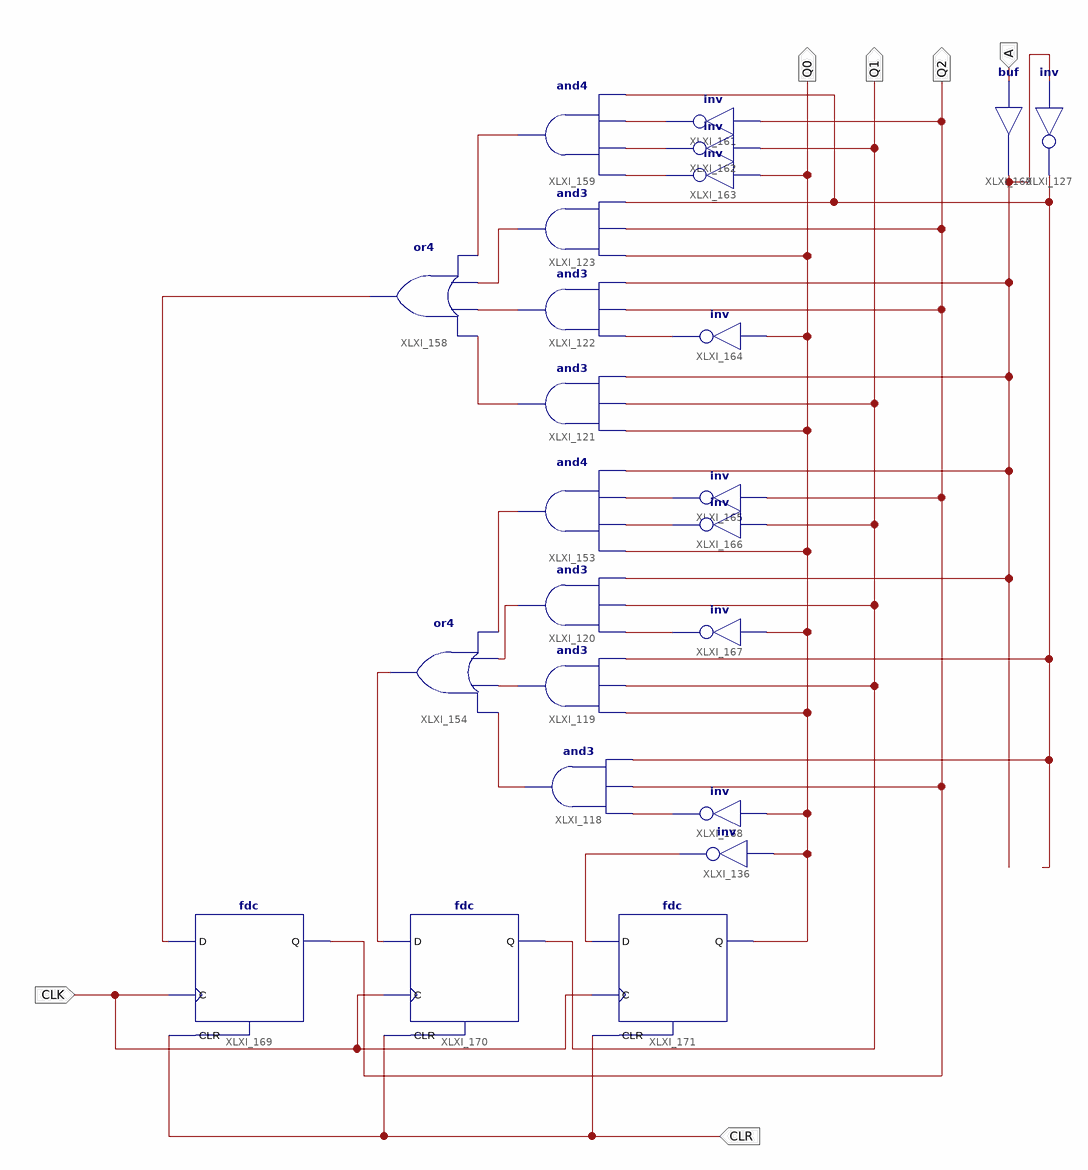
[diagram p0: schematic sheet 1]
// Xilinx ISE schematic Module_Six_Up_Down_Counter.sch (spartan3e) as structural Verilog: 24 symbols, 6 ports
module Module_Six_Up_Down_Counter (
  input  CLK,
  input  A,
  input  CLR,
  output Q0,
  output Q1,
  output Q2
);

  wire XLXN_157, XLXN_158, XLXN_159, XLXN_161, XLXN_162, XLXN_163, XLXN_166, XLXN_189, XLXN_211, XLXN_222,
       XLXN_223, XLXN_227, XLXN_237, XLXN_238, XLXN_239, XLXN_240, XLXN_241, XLXN_242, XLXN_243, XLXN_244,
       XLXN_245;

  not XLXI_127 (XLXN_237, XLXN_227);
  and XLXI_120 (XLXN_157, XLXN_227, Q1, XLXN_244);
  and XLXI_118 (XLXN_159, XLXN_237, Q2, XLXN_245);
  not XLXI_136 (XLXN_189, Q0);
  and XLXI_123 (XLXN_222, XLXN_237, Q2, Q0);
  and XLXI_121 (XLXN_162, XLXN_227, Q1, Q0);
  and XLXI_153 (XLXN_211, XLXN_227, XLXN_242, XLXN_243, Q0);
  or XLXI_154 (XLXN_163, XLXN_211, XLXN_157, XLXN_158, XLXN_159);
  and XLXI_119 (XLXN_158, XLXN_237, Q1, Q0);
  and XLXI_122 (XLXN_161, XLXN_227, Q2, XLXN_241);
  or XLXI_158 (XLXN_166, XLXN_223, XLXN_222, XLXN_161, XLXN_162);
  and XLXI_159 (XLXN_223, XLXN_237, XLXN_238, XLXN_239, XLXN_240);
  buf XLXI_160 (XLXN_227, A);
  not XLXI_161 (XLXN_238, Q2);
  not XLXI_162 (XLXN_239, Q1);
  not XLXI_163 (XLXN_240, Q0);
  not XLXI_164 (XLXN_241, Q0);
  not XLXI_165 (XLXN_242, Q2);
  not XLXI_166 (XLXN_243, Q1);
  not XLXI_167 (XLXN_244, Q0);
  not XLXI_168 (XLXN_245, Q0);
  fdc XLXI_169 (.C(CLK), .CLR(CLR), .D(XLXN_166), .Q(Q2));
  fdc XLXI_170 (.C(CLK), .CLR(CLR), .D(XLXN_163), .Q(Q1));
  fdc XLXI_171 (.C(CLK), .CLR(CLR), .D(XLXN_189), .Q(Q0));
endmodule
